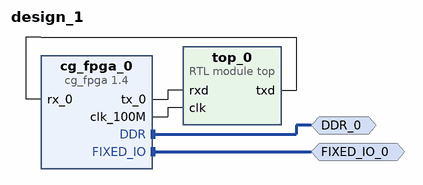
[diagram p0: block diagram of the top level]
# Vivado block design design_1, xc7z020clg400-1, Vivado 2018.3
create_bd_design design_1

create_bd_intf_port -mode Master -vlnv xilinx.com:interface:ddrx_rtl:1.0 DDR_0
create_bd_intf_port -mode Master -vlnv xilinx.com:display_processing_system7:fixedio_rtl:1.0 FIXED_IO_0

create_bd_cell -type module -reference top top_0
create_bd_cell -type ip -vlnv educg.net:user:cg_fpga:1.4 cg_fpga_0

# ---- connections ----

connect_bd_intf_net [get_bd_intf_ports DDR_0] [get_bd_intf_pins cg_fpga_0/DDR]
connect_bd_intf_net [get_bd_intf_ports FIXED_IO_0] [get_bd_intf_pins cg_fpga_0/FIXED_IO]
connect_bd_net [get_bd_pins top_0/txd] [get_bd_pins cg_fpga_0/rx_0]
connect_bd_net [get_bd_pins cg_fpga_0/tx_0] [get_bd_pins top_0/rxd]
connect_bd_net [get_bd_pins cg_fpga_0/clk_100M] [get_bd_pins top_0/clk]

validate_bd_design
save_bd_design
